# EasyEDA Pro project Project.epro

# Schematic Schematic1
Board Name: Board1; Create Date: 2024-01-20; Page Name: P1; Project Name: Klingelanlage; Schematic Name: Schematic1; Update Date: 2024-10-29; Company: EasyEDA.com; Drawed: EasyEDA Pro; Page Size: A4; Part Number: JLCPCB-002; Reviewed: EasyEDA Pro; Version: V0.1
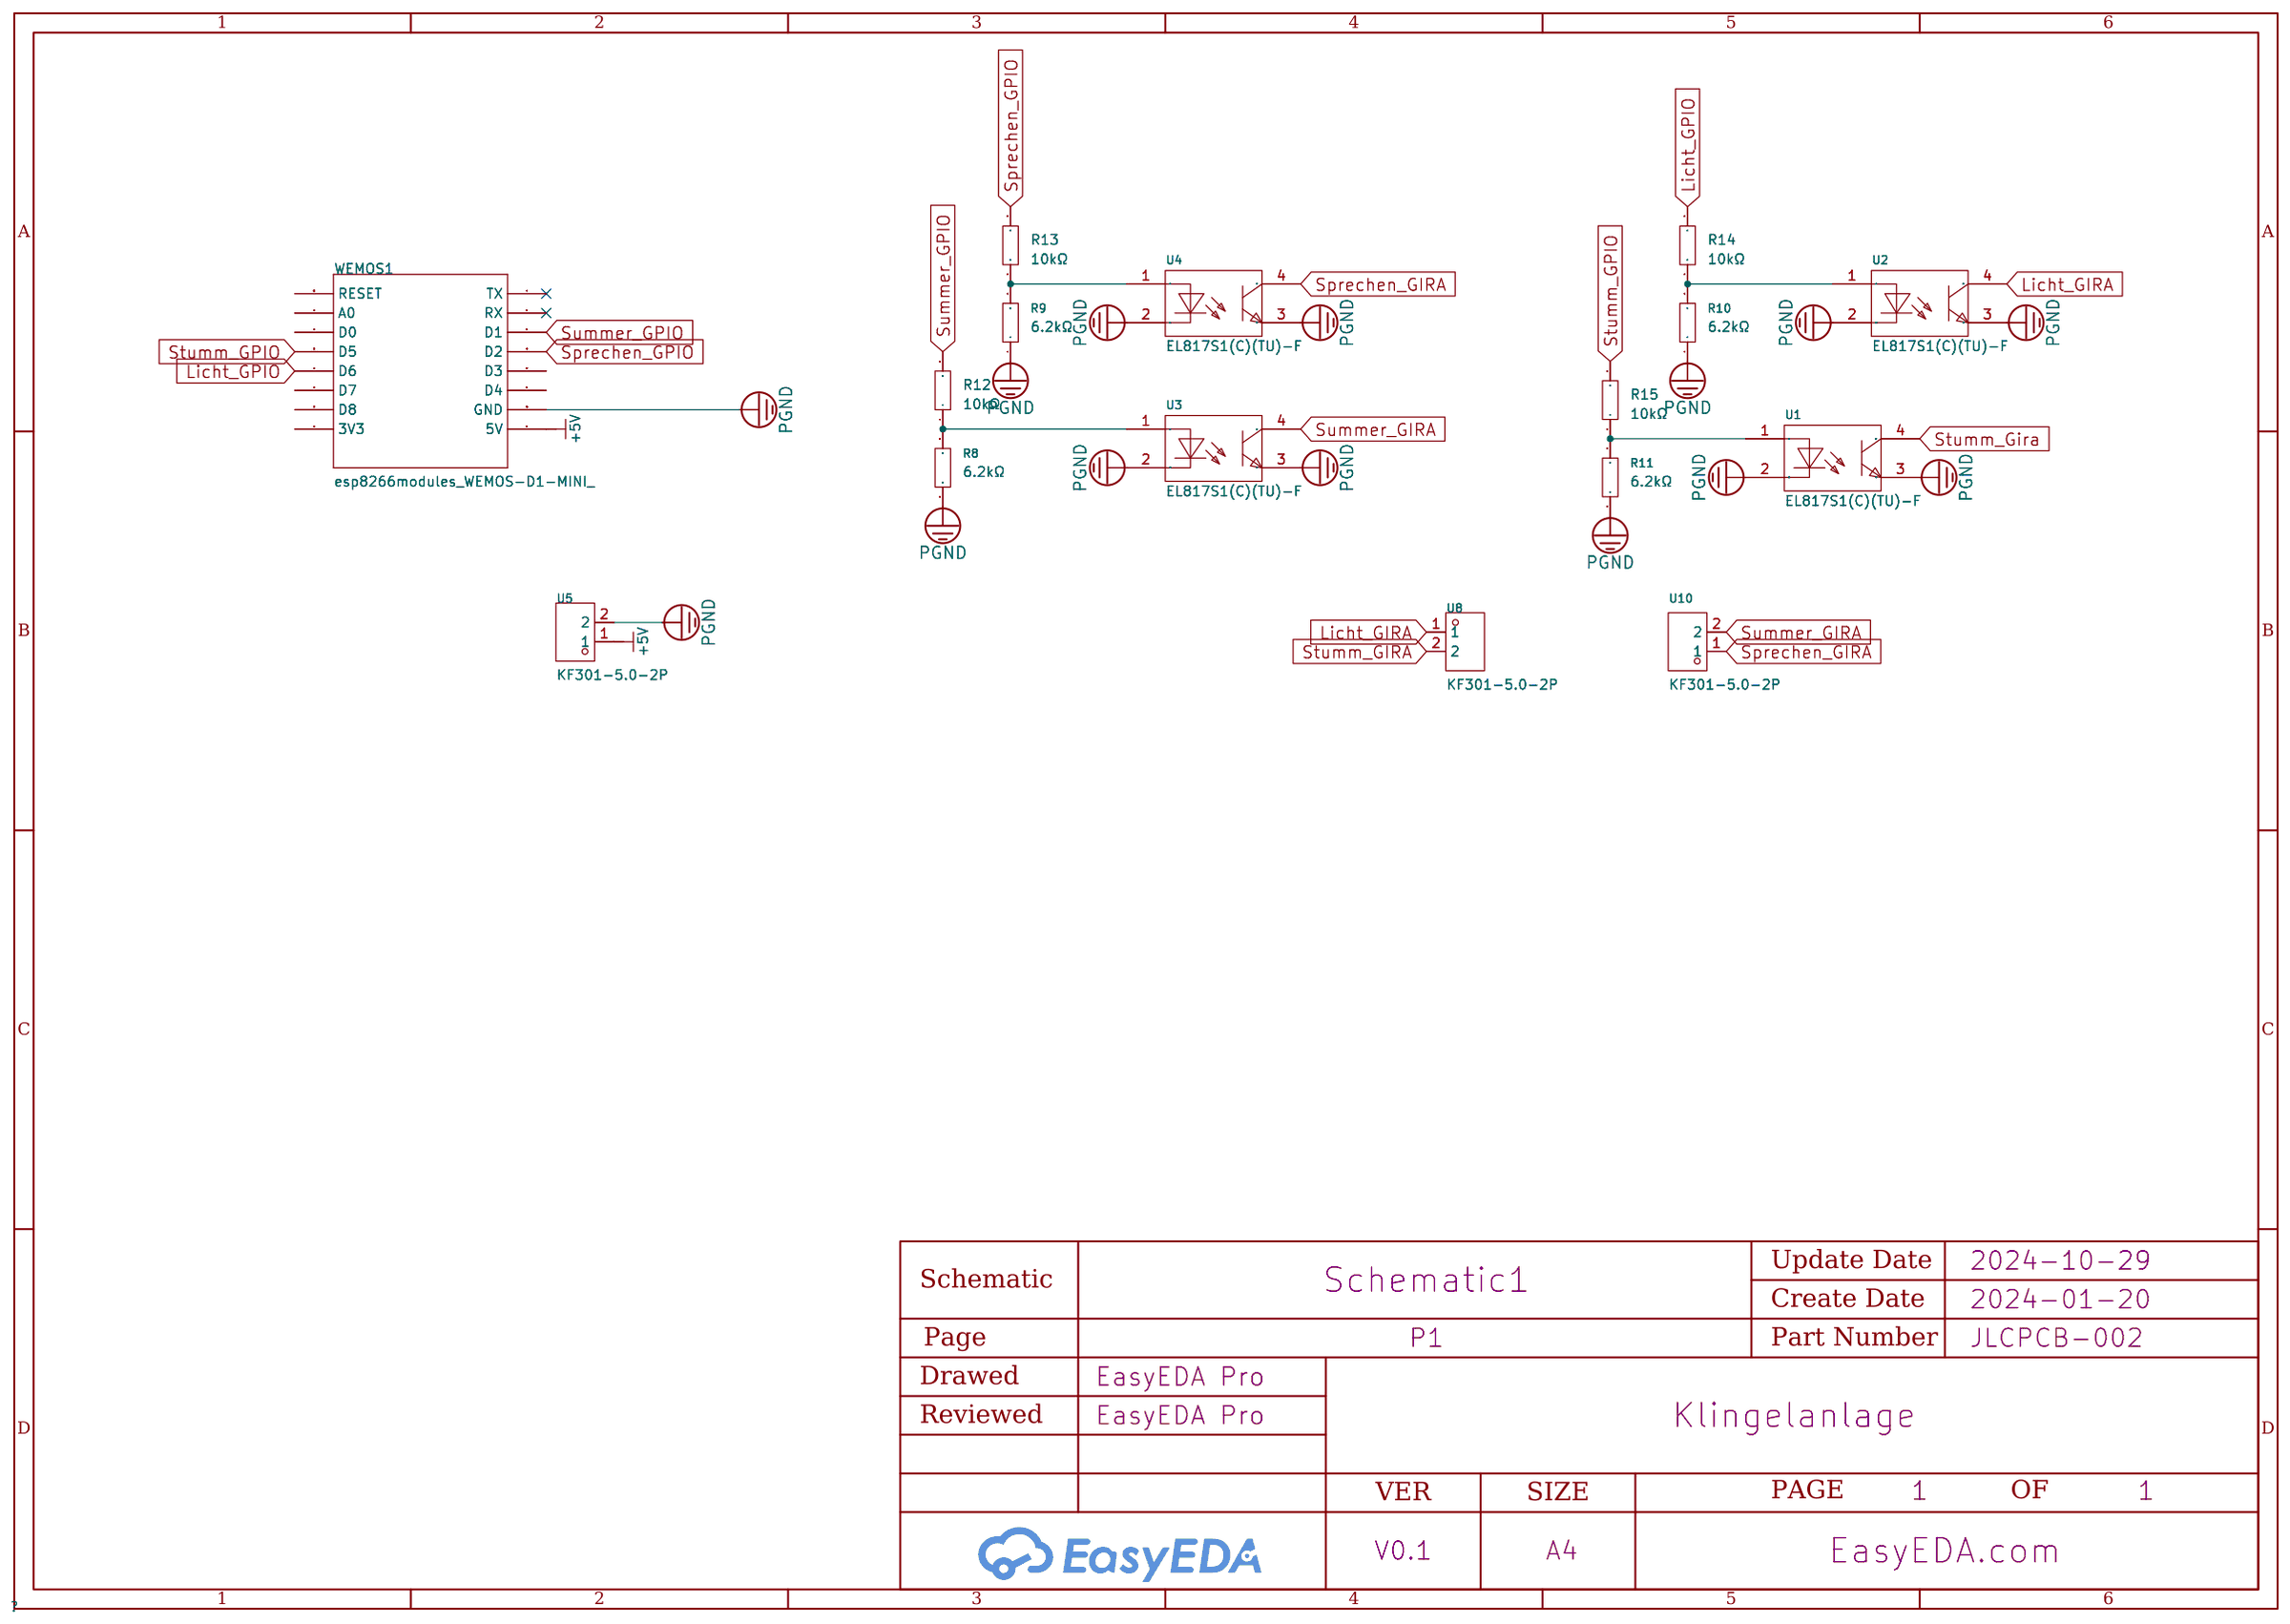
[diagram p0: schematic sheet]

## Parts
R8  6.2kΩ  [R0603]  (no BOM)
R9  6.2kΩ  [R0603]  (no BOM)
R10  6.2kΩ  [R0603]  (no BOM)
R11  6.2kΩ  [R0603]  (no BOM)
R12  10kΩ  [R0603]  (no BOM)
R13  10kΩ  [R0603]  (no BOM)
R14  10kΩ  [R0603]  (no BOM)
R15  10kΩ  [R0603]  (no BOM)
U1  EL817S1(C)(TU)-F  [OPTO-SMD-4_L4.6-W6.5-P2.54-LS10.3-TL]
U2  EL817S1(C)(TU)-F  [OPTO-SMD-4_L4.6-W6.5-P2.54-LS10.3-TL]
U3  EL817S1(C)(TU)-F  [OPTO-SMD-4_L4.6-W6.5-P2.54-LS10.3-TL]
U4  EL817S1(C)(TU)-F  [OPTO-SMD-4_L4.6-W6.5-P2.54-LS10.3-TL]
U5  KF301-5.0-2P  [CONN-TH_P5.00_KF301-5.0-2P]
U8  KF301-5.0-2P  [CONN-TH_P5.00_KF301-5.0-2P]
U10  KF301-5.0-2P  [CONN-TH_P5.00_KF301-5.0-2P]
WEMOS1  esp8266modules_WEMOS-D1-MINI_  [WEMOS-D1-MINI]

## Library data of the parts
R8-R11 = RMC06036.2K1%N: Resistance: Tolerance:±1% Tolerance:±1% Power(Watts):; LCSC Part Name: 6.2kΩ ±1% 100mW; Supplier Part: C325649; Manufacturer: Tyohm(幸亚电阻); Supplier Footprint: 0603; Datasheet: https://atta.szlcsc.com/upload/public/pdf/source/20190115/C325956_D27151D492FFB3C9AB4A6F14FE01F30A.pdf; Supplier: LCSC; Tolerance: ±1%
R12-R15 = RC0603FR-0710KL: Type:Thick Film Resistors Resistance: Tolerance:±1% Tolerance:±1% Power(Watts): Overload Voltage (Max): Temperature Coefficient:±100ppm/℃ Temperature Coefficient:±100ppm/℃ Operating Temperature Range:-55℃~+155℃ Operating Temperature Range:-55℃~+155℃; LCSC Part Name: 厚膜电阻 10kΩ ±1% 100mW; Supplier Part: C98220; Manufacturer: YAGEO(国巨); Supplier Footprint: 0603; Datasheet: https://atta.szlcsc.com/upload/public/pdf/source/20180927/C295883_E8D83085EA81BD7DE0B2B681138C15EE.pdf; Supplier: LCSC; Type: Thick Film Resistors; Tolerance: ±1%; Temperature Coefficient: ±100ppm/℃; Operating Temperature Range: -55℃~+155℃
U1-U4 = EL817S1(C)(TU)-F_C106900: Input voltage type:DC Output Type:光电三极管 Forward Voltage:1.2V Output Current:50mA Isolation Voltage(rms):5000V Reverse Voltage:6V Receiving End Voltage:35V Number of Outputs:1 Collector-Emitter Saturation Voltage (Vce(sat)@Ic,IF):0.1V@1mA,20mA Rise time:18; LCSC Part Name: DC输入 隔离电压(rms):5000V; Supplier Part: C106900; Manufacturer: EVERLIGHT(亿光); Supplier Footprint: SMD-4P; Datasheet: https://atta.szlcsc.com/upload/public/pdf/source/20181026/C323798_FBCE14484708FE0807B9A090D624C4F0.pdf; Supplier: LCSC; Input voltage type: DC; Output Type: 光电三极管; Forward Voltage: 1.2V; Output Current: 50mA; Isolation Voltage(rms): 5000V; Reverse Voltage: 6V; Receiving End Voltage: 35V; Number of Outputs: 1; Collector-Emitter Saturation Voltage (Vce(sat)@Ic,IF): 0.1V@1mA,20mA; Rise time: 18us@2mA,100Ω; Fall time: 18us@2mA,100Ω; Operating Temperature: -55℃~+110℃
U5 U8 U10 = KF301-5.0-2P: Pitch:5mm Structure:1x2P Number of Rows:1 Number of PINs Per Row:2 Mounting Style:Straight Current Rating (Max):17A Voltage Rating (Max):250V Wire Gauge - AWG:14~22 Wire Gauge - AWG:14~22 Wire Gauge - mm2:1.5 Wire Gauge - mm2:1.5 Operating Temperature Ran; LCSC Part Name: 5mm 1x2P 排数:1 每排P数:2 直插 可拼接 铜 环保; Supplier Part: C474881; Manufacturer: KEFA(科发); Supplier Footprint: 插件,P=5mm; JLCPCB Part Class: Extended Part; Datasheet: https://atta.szlcsc.com/upload/public/pdf/source/20230317/03A5B5FC229D6F9225E8F51DA1A4E80A.pdf; Supplier: LCSC; Pitch: 5mm; Structure: 1x2P; Number of Rows: 1; Number of PINs Per Row: 2; Mounting Style: Straight; Current Rating (Max): 17A; Voltage Rating (Max): 250V; Wire Gauge - AWG: 14~22; Wire Gauge - mm2: 1.5; Operating Temperature Range: -30℃~+120℃; Color: Blue; Number of Pins: 2P
WEMOS1 = esp8266modules_WEMOS-D1-MINI_

## Nets
+5V: U5.1 WEMOS1.5V
PGND: R8.1 R9.1 R10.1 R11.1 U1.2(CAT) U1.3(EM) U2.2(CAT) U2.3(EM) U3.2(CAT) U3.3(EM) U4.2(CAT) U4.3(EM) U5.2 WEMOS1.GND
Licht_GIRA: U2.4(COL) U8.1
Licht_GPIO: R14.2 WEMOS1.D6
Sprechen_GIRA: U4.4(COL) U10.1
Sprechen_GPIO: R13.2 WEMOS1.D2
Stumm_Gira: U1.4(COL)
Stumm_GIRA: U8.2
Stumm_GPIO: R15.2 WEMOS1.D5
Summer_GIRA: U3.4(COL) U10.2
Summer_GPIO: R12.2 WEMOS1.D1
$1N1280: R9.2 R13.1 U4.1(AN)
$1N1424: R8.2 R12.1 U3.1(AN)
$1N1497: R10.2 R14.1 U2.1(AN)
$1N1575: R11.2 R15.1 U1.1(AN)

Not connected (* = marked no-connect by the designer): WEMOS1 3V3 A0 D0 D3 D4 D7 D8 RESET RX* TX*

# Board PCB1
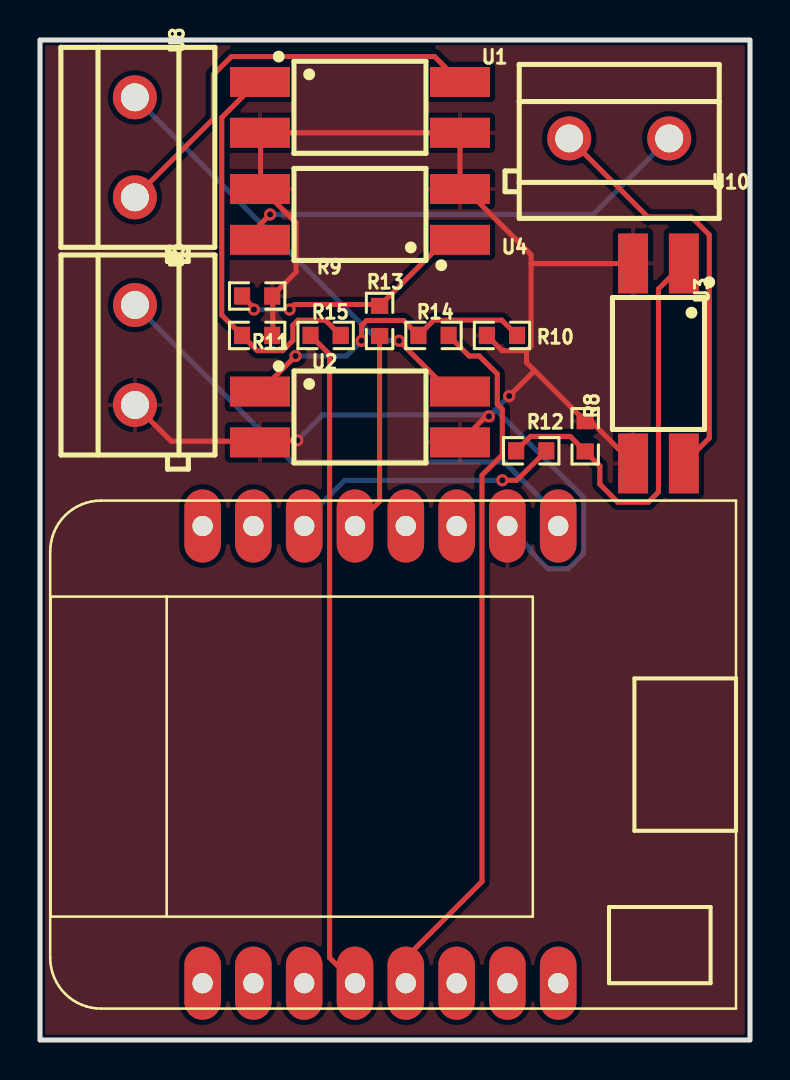
[diagram p1: board, top side]
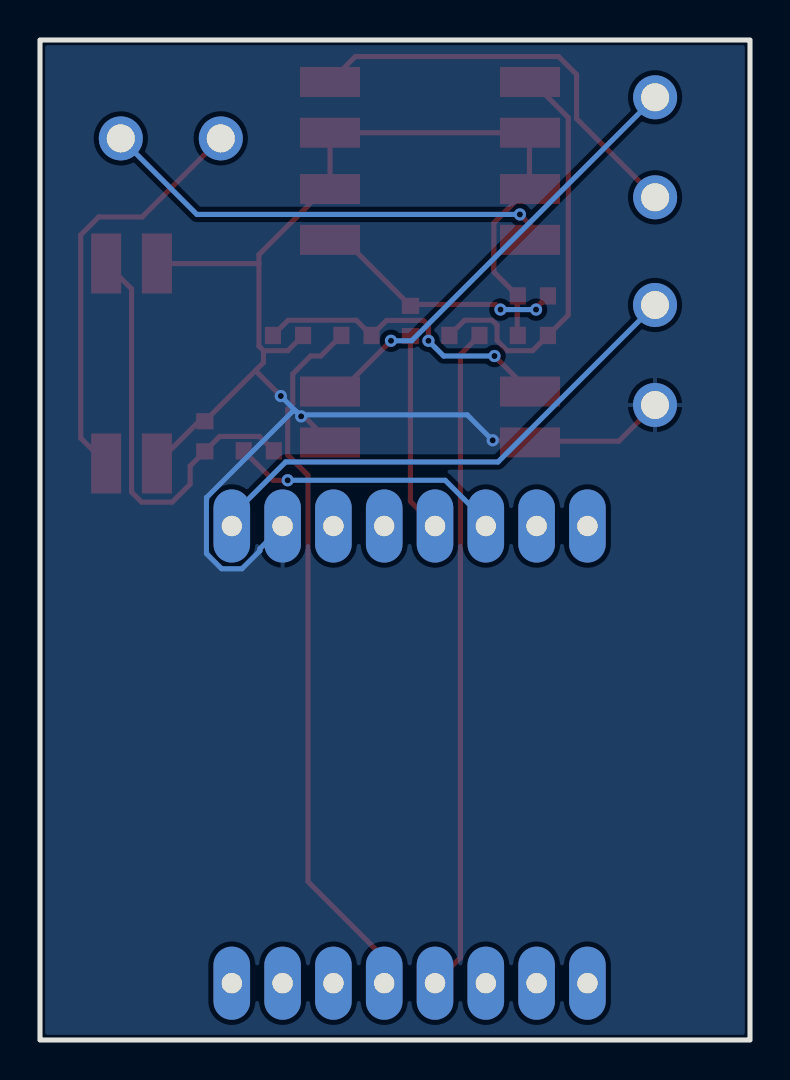
[diagram p2: board, bottom side, seen from below]

Outline 35.5 x 50 mm; copper layers: Top Layer, Bottom Layer. Coordinates in mm from the lower left corner of the outline.
Outline path: rectangle 0,50 35.5,0
Stack: Top Layer 0.035mm / Dielectric1 1.51mm FR4 er 4.5 / Bottom Layer 0.035mm

## Design rules (mm)
template: JLCPCB Capability(Two Layers Board)
spacing copperThickness1oz (default): track to track 0.102, other pairs 0.152 to 0.3
spacing copperThickness2oz: track to track 0.203, other pairs 0.152 to 0.3
track width copperThickness1oz (default): min 0.127, default 0.254, max 2.54
track width copperThickness2oz: min 0.203, default 0.254, max 2.54
differential pair differentialPair (default): width min 0.127, default 0.254, max 2.54; gap min 0.152, default 0.152
via viaSize (default): diameter min 0.5, default 0.61, max 10; hole min 0.3, default 0.305, max 6.3

## Placement (name value [footprint] x y rotation side)
R8  6.2kΩ  [R0603]  27.26 30.19 270 top
R9  6.2kΩ  [R0603]  10.86 37.2 180 top
R10  6.2kΩ  [R0603]  23.1 35.23 0 top
R11  6.2kΩ  [R0603]  10.86 35.23 180 top
R12  10kΩ  [R0603]  24.56 29.46 0 top
R13  10kΩ  [R0603]  16.98 35.95 270 top
R14  10kΩ  [R0603]  19.68 35.23 0 top
R15  10kΩ  [R0603]  14.28 35.23 180 top
U1  EL817S1(C)(TU)-F  [OPTO-SMD-4_L4.6-W6.5-P2.54-LS10.3-TL]  16 46.63 0 top
U2  EL817S1(C)(TU)-F  [OPTO-SMD-4_L4.6-W6.5-P2.54-LS10.3-TL]  16 31.15 0 top
U3  EL817S1(C)(TU)-F  [OPTO-SMD-4_L4.6-W6.5-P2.54-LS10.3-TL]  30.92 33.83 270 top
U4  EL817S1(C)(TU)-F  [OPTO-SMD-4_L4.6-W6.5-P2.54-LS10.3-TL]  16 41.28 180 top
U5  KF301-5.0-2P  [CONN-TH_P5.00_KF301-5.0-2P]  4.75 34.25 270 top
U8  KF301-5.0-2P  [CONN-TH_P5.00_KF301-5.0-2P]  4.74 44.63 270 top
U10  KF301-5.0-2P  [CONN-TH_P5.00_KF301-5.0-2P]  28.96 45.08 180 top
WEMOS1  esp8266modules_WEMOS-D1-MINI_  [WEMOS-D1-MINI]  15.75 13 90 top

## Footprints (pads in the part's own frame, mm; a bottom-side part is the same pattern mirrored in y, then rotated)
CONN-TH_P5.00_KF301-5.0-2P
  round 2.2 hole 1.4: 1(-2.5,0) 2(2.5,0)
OPTO-SMD-4_L4.6-W6.5-P2.54-LS10.3-TL
  rect 3x1.5 smd: 1(-5,1.27) 2(-5,-1.27) 3(5,-1.27) 4(5,1.27)
R0603
  rect 0.806x0.864 smd: 1(-0.753,0) 2(0.753,0)
WEMOS-D1-MINI
  oval 3.658x1.829 hole 1.016: 3V3(-10.16,-10.16) 5V(12.7,-10.16) A0(-10.16,5.08) D0(-10.16,2.54) D1(12.7,2.54) D2(12.7,0) D3(12.7,-2.54) D4(12.7,-5.08) D5(-10.16,0) D6(-10.16,-2.54) D7(-10.16,-5.08) D8(-10.16,-7.62) GND(12.7,-7.62) RESET(-10.16,7.62) RX(12.7,5.08) TX(12.7,7.62)

## Nets
+5V: U5.1 WEMOS1.5V
PGND: R8.1 R9.1 R10.1 R11.1 U1.2 U1.3 U2.2 U2.3 U3.2 U3.3 U4.2 U4.3 U5.2 WEMOS1.GND
LICHT_GIRA: U2.4 U8.1
LICHT_GPIO: R14.2 WEMOS1.D6
SPRECHEN_GIRA: U4.4 U10.1
SPRECHEN_GPIO: R13.2 WEMOS1.D2
STUMM_GIRA: U1.4 U8.2
STUMM_GPIO: R15.2 WEMOS1.D5
SUMMER_GIRA: U3.4 U10.2
SUMMER_GPIO: R12.2 WEMOS1.D1
$1N1280: R9.2 R13.1 U4.1
$1N1424: R8.2 R12.1 U3.1
$1N1497: R10.2 R14.1 U2.1
$1N1575: R11.2 R15.1 U1.1

Pads without a net: WEMOS1 3V3 A0 D0 D3 D4 D7 D8 RESET RX TX

## Via types
v1: diameter 0.61, hole 0.305, Top Layer to Bottom Layer, 10 vias

## Routing (per net, layer and track width the routed paths; a pad name or vN(x,y) marks a point on that pad's centre or on a via; arc(x,y) is an arc through that point)
+5V: length 26
  Bottom Layer w0.254: U5.1 12.6,28.9 23.22,28.9 25.91,26.21 WEMOS1.5V
PGND: length 88
  Top Layer w0.254: 24.73,33.47 v1(23.46,32.2) ; 24.73,33.47 24.33,33.87 24.33,34.47 ; 24.73,33.47 R8.1 27.54,30.94 U3.3 ; 24.55,38.82 24.55,39.27 21.25,42.57 21,42.57 ; 24.55,38.82 29.65,38.82 ; 24.55,38.82 24.55,34.69 24.33,34.47 ; R10.1 23.11,34.47 24.33,34.47 ; 11.03,42.63 11.03,42.58 U4.3 ; 11.03,42.63 11.03,45.36 ; 11.03,42.63 12.81,40.85 12.81,38.4 11.64,37.23 ; 11.06,29.94 U2.2 ; 11.06,29.94 11.1,29.98 v1(12.87,29.98) ; 11.06,29.94 6.56,29.94 U5.2 ; 11.03,45.36 U1.2 ; 11.03,45.36 U1.3 21,42.57 ; 21,42.57 U4.2 ; 11.64,37.23 R9.1 ; 11.64,37.23 11.64,35.26 R11.1 ; v1(22.44,31.18) 22.3,31.18 U2.3
  Bottom Layer w0.254: 22.52,31.25 v1(22.44,31.18) ; 22.52,31.25 22.7,31.44 ; 22.52,31.25 14.13,31.25 v1(12.87,29.98) ; v1(23.46,32.2) 22.7,31.44 ; 22.7,31.44 22.86,31.44 27.18,27.12 27.18,24.32 26.42,23.56 25.4,23.56 24.5,24.46 24.5,24.57 WEMOS1.GND
LICHT_GIRA: length 22.3
  Top Layer w0.254: v1(17.95,34.96) 20.49,32.42 U2.4
  Bottom Layer w0.254: U8.1 16.92,34.96 v1(17.95,34.96)
LICHT_GPIO: length 35.8
  Top Layer w0.254: R14.2 21.46,34.2 21.96,34.2 22.86,33.3 22.86,31.8 23.12,31.54 23.12,29.26 22.1,28.24 22.1,7.92 18.29,4.11 WEMOS1.D6
SPRECHEN_GIRA: length 23
  Top Layer w0.254: v1(11.51,41.28) 11,40.77 U4.4
  Bottom Layer w0.254: v1(11.51,41.28) 27.66,41.28 U10.1
SPRECHEN_GPIO: length 10
  Top Layer w0.254: R13.2 16.98,26.93 WEMOS1.D2
STUMM_GIRA: length 21
  Top Layer w0.254: U8.2 8.67,46.06 8.67,48.27 9.57,49.17 19.73,49.17 U1.4
STUMM_GPIO: length 33.3
  Top Layer w0.254: 13.53,35.23 14.48,34.27 14.48,4.11 WEMOS1.D5
SUMMER_GIRA: length 21
  Top Layer w0.254: U10.2 30.39,41.15 32.57,41.15 33.46,40.26 33.46,30.1 U3.4
SUMMER_GPIO: length 13.8
  Top Layer w0.254: v1(23.12,27.99) 23.84,27.99 R12.2
  Bottom Layer w0.254: v1(23.12,27.99) 15.24,27.99 13.21,25.95 WEMOS1.D1
$1N1280: length 12.8
  Top Layer w0.254: 17.05,36.78 12.73,36.78 v1(12.48,36.52) ; 17.05,36.78 R13.1 ; 17.05,36.78 20.28,40.01 U4.1 ; v1(10.7,36.52) 10.7,36.61 R9.2
  Bottom Layer w0.254: v1(12.48,36.52) v1(10.7,36.52)
$1N1424: length 21.5
  Top Layer w0.254: R12.1 24.53,30.18 26.51,30.18 R8.2 27.99,28.7 27.99,27.79 28.89,26.89 30.42,26.89 30.92,27.4 30.92,37.56 U3.1
$1N1497: length 15.7
  Top Layer w0.254: v1(16.08,34.96) 16.08,35.72 16.33,35.98 18.17,35.98 R14.1 19.69,35.99 23.09,35.99 R10.2 ; U2.1 v1(12.78,34.2)
  Bottom Layer w0.254: v1(16.08,34.96) 15.32,34.2 v1(12.78,34.2)
$1N1575: length 20.6
  Top Layer w0.254: R15.1 14.27,35.99 12.9,35.99 12.64,35.74 12.64,34.97 12.14,34.47 10.87,34.47 R11.2 9.09,36.24 9.09,46.12 10.87,47.9 U1.1

## Copper pours and planes (outline as drawn; the poured copper is in the pictures)
PGND on Top Layer: -0.75,50.75 36.25,50.75 36.25,-0.5 -0.75,-0.5
PGND on Bottom Layer: -2,52.25 37.25,52.25 37.25,-1.5 -2,-1.5
